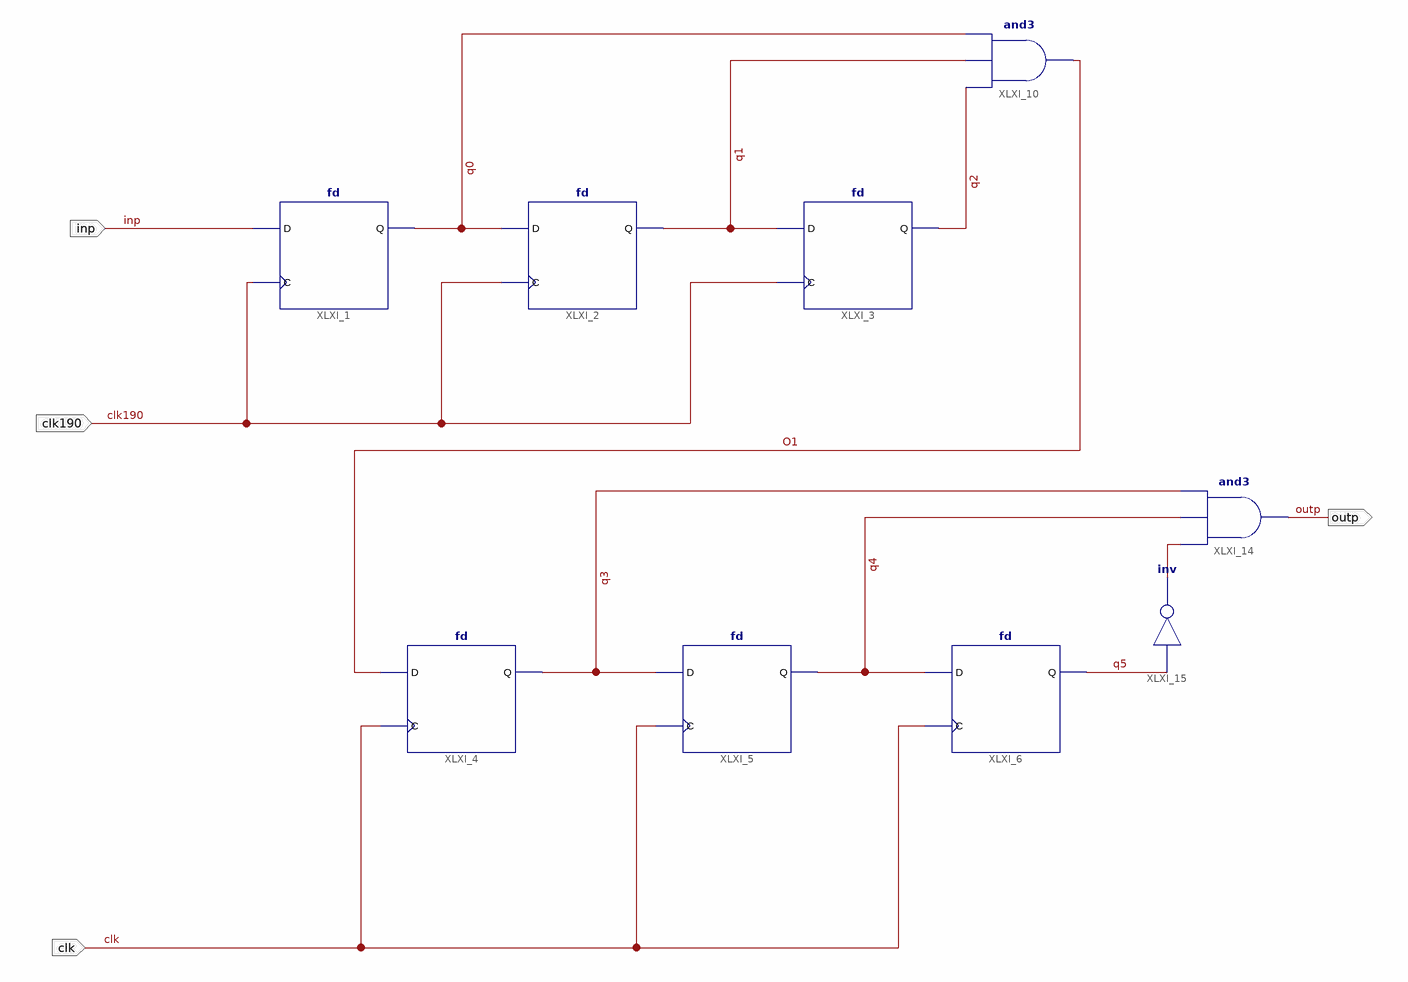
[diagram p0: schematic sheet 1]
// Xilinx ISE schematic pulse.sch (spartan3e) as structural Verilog: 9 symbols, 4 ports
module pulse (
  input  clk190,
  input  inp,
  input  clk,
  output outp
);

  wire O1, q0, q1, q2, q3, q4, q5, XLXN_26;

  fd XLXI_1 (.C(clk190), .D(inp), .Q(q0));
  fd XLXI_2 (.C(clk190), .D(q0), .Q(q1));
  fd XLXI_3 (.C(clk190), .D(q1), .Q(q2));
  and XLXI_10 (O1, q2, q1, q0);
  fd XLXI_4 (.C(clk), .D(O1), .Q(q3));
  fd XLXI_6 (.C(clk), .D(q4), .Q(q5));
  fd XLXI_5 (.C(clk), .D(q3), .Q(q4));
  and XLXI_14 (outp, XLXN_26, q4, q3);
  not XLXI_15 (XLXN_26, q5);
endmodule
